# Altium schematic sheet ZYNQ JTAG and Decoupling.SchDoc
size A3; SheetNumber: 4; SheetTotal: 13; SPICEModelCacheIAXUMUHC: <root> / <DocumentId>IAXUMUHC</DocumentId> / <CacheFrame Number="0"> / <Model Name="led3" Kind="MDL"> / <Text>*Typ BLUE SiC LED: Vf=3.4V Vr=5V If=40mA trr=3uS / *LED Pinout: 1=A, 2=K / .MODEL LED3 D (IS=93.1P RS=42M N=7.47 BV=5 IBV=30U / + CJO=2.97P VJ=.75 M=.333 TT=4.32U)</Text> / </Model> / </CacheFrame> / </root>
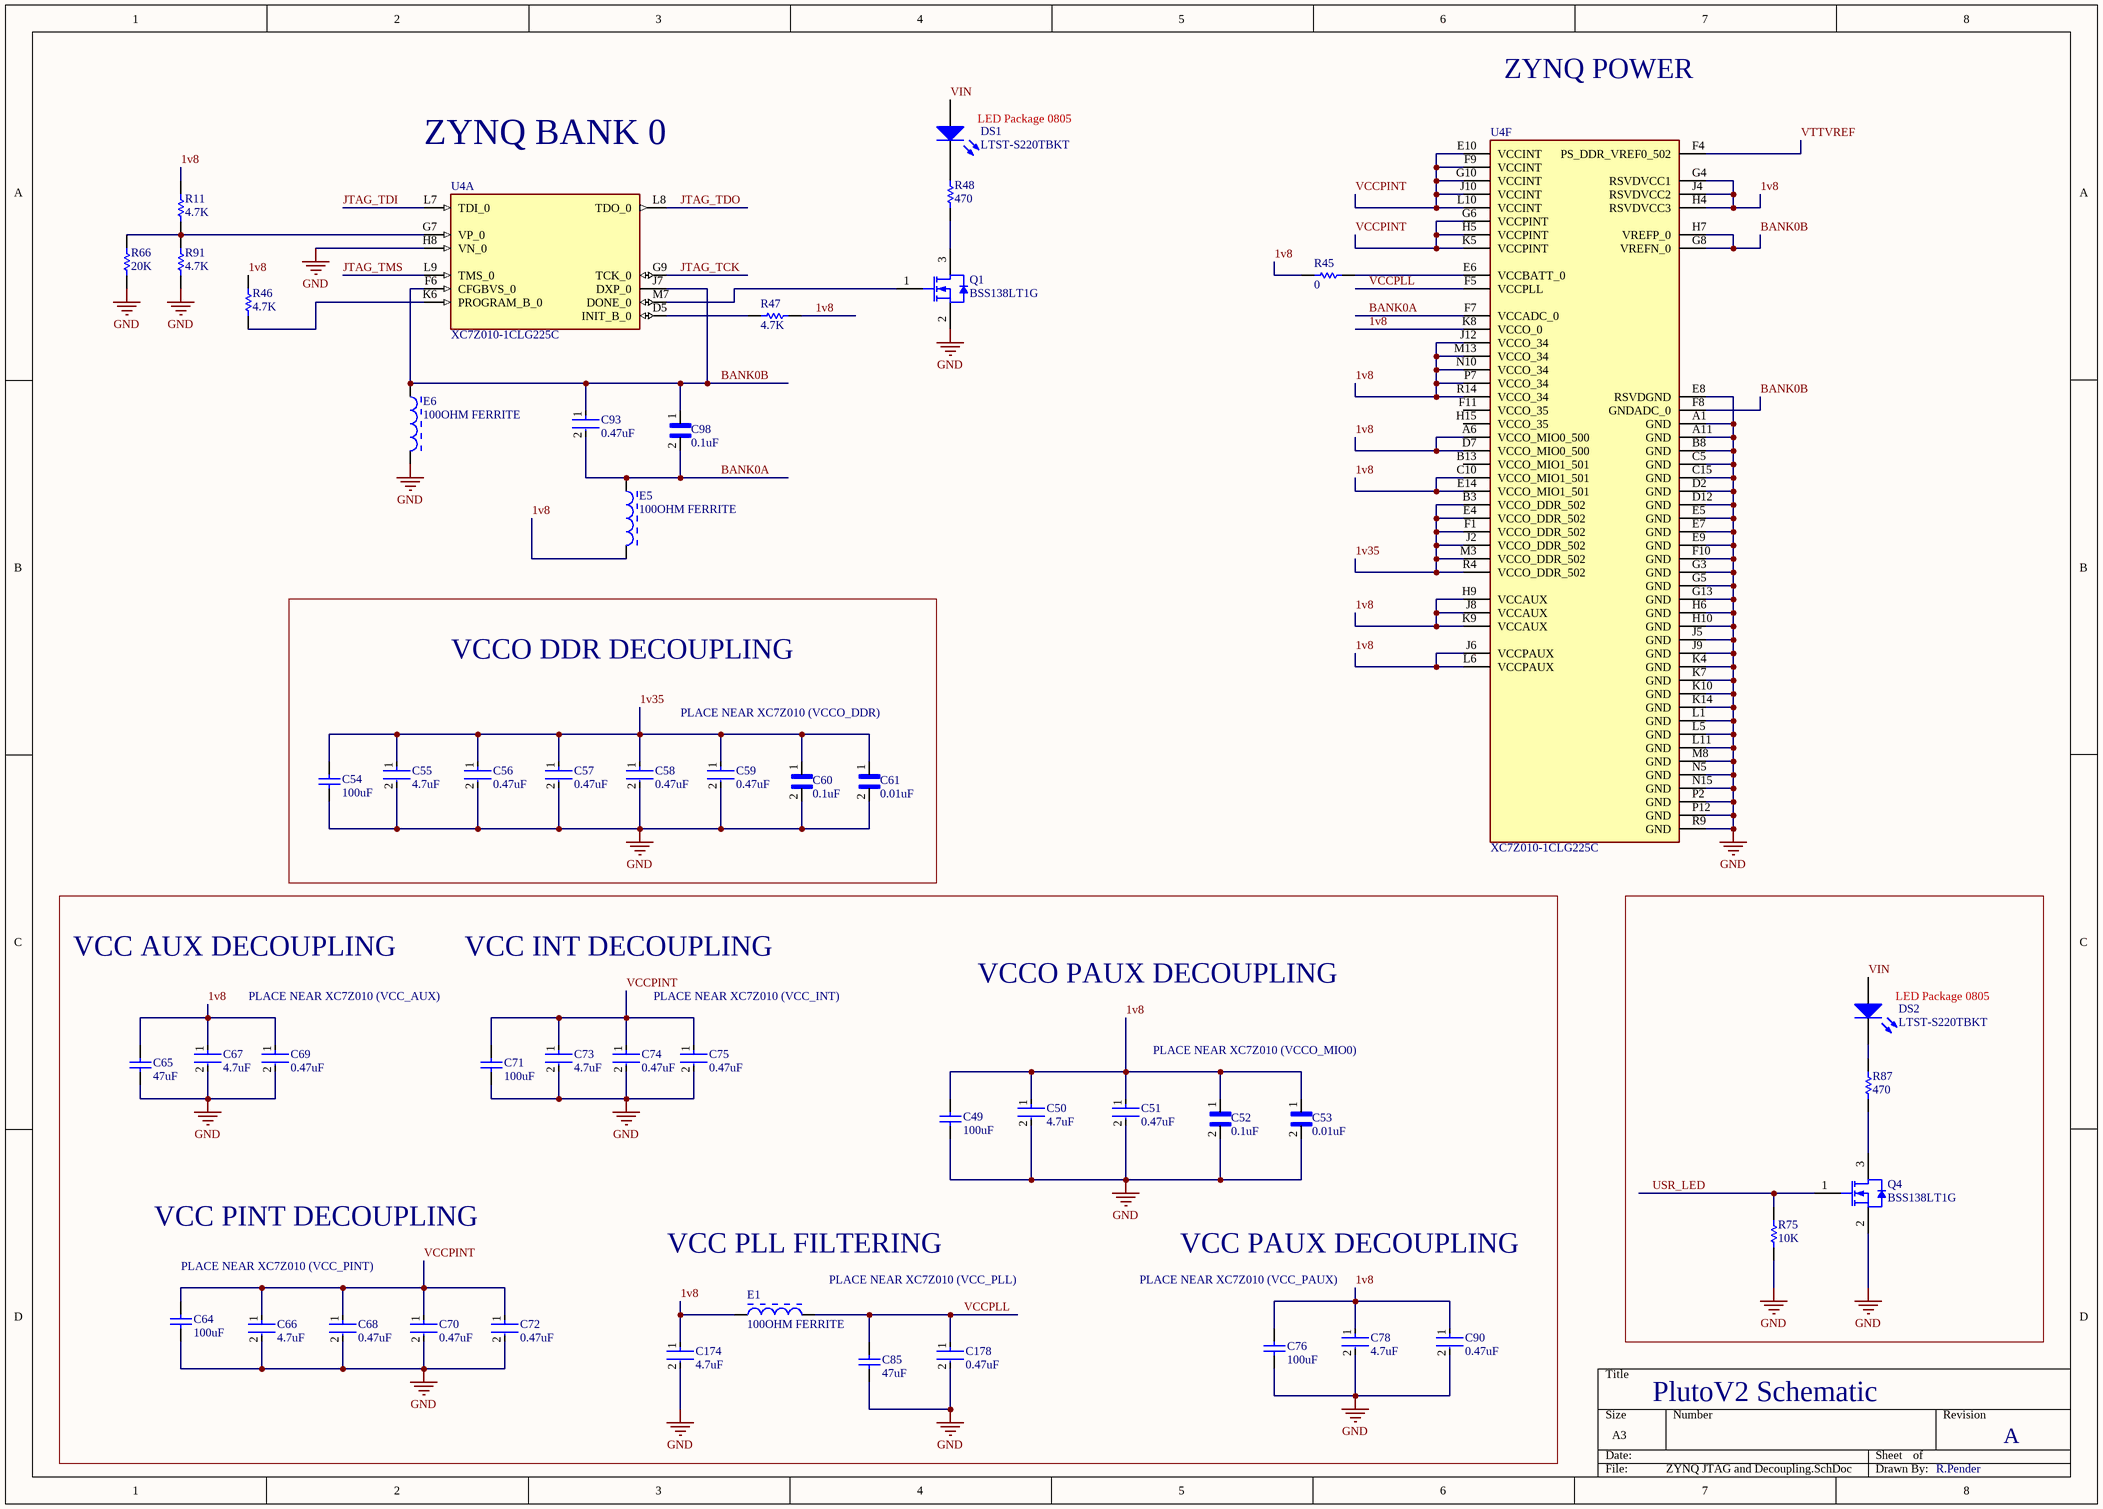
[diagram p0: ZYNQ JTAG and Decoupling.SchDoc]

## Parts
C49  100uF  [CAPC3216X190X55ML30T25]
C50  4.7uF  [FP-C1005-050-0_15-MFG]
C51  0.47uF  [FP-C1005-050-0_15-MFG]
C52  0.1uF  [CAPC0603X33N]
C53  0.01uF  [CAPC0603X33N]
C54  100uF  [CAPC3216X190X55ML30T25]
C55  4.7uF  [FP-C1005-050-0_15-MFG]
C56  0.47uF  [FP-C1005-050-0_15-MFG]
C57  0.47uF  [FP-C1005-050-0_15-MFG]
C58  0.47uF  [FP-C1005-050-0_15-MFG]
C59  0.47uF  [FP-C1005-050-0_15-MFG]
C60  0.1uF  [CAPC0603X33N]
C61  0.01uF  [CAPC0603X33N]
C64  100uF  [CAPC3216X190X55LL30T25]
C65  47uF  [TAYO-JMK212BBJ476MG-T_L]
C66  4.7uF  [FP-C1005-050-0_15-MFG]
C67  4.7uF  [FP-C1005-050-0_15-MFG]
C68  0.47uF  [FP-C1005-050-0_15-MFG]
C69  0.47uF  [FP-C1005-050-0_15-MFG]
C70  0.47uF  [FP-C1005-050-0_15-MFG]
C71  100uF  [CAPC3216X190X55LL30T25]
C72  0.47uF  [FP-C1005-050-0_15-MFG]
C73  4.7uF  [FP-C1005-050-0_15-MFG]
C74  0.47uF  [FP-C1005-050-0_15-MFG]
C75  0.47uF  [FP-C1005-050-0_15-MFG]
C76  100uF  [CAPC3216X190X55LL30T25]
C78  4.7uF  [FP-C1005-050-0_15-MFG]
C85  47uF  [TAYO-JMK212BBJ476MG-T_L]
C90  0.47uF  [FP-C1005-050-0_15-MFG]
C93  0.47uF  [FP-C1005-050-0_15-MFG]
C98  0.1uF  [CAPC0603X33N]
C174  4.7uF  [FP-C1005-050-0_15-MFG]
C178  0.47uF  [FP-C1005-050-0_15-MFG]
DS1  LTST-S220TBKT  [CAPC2012X135N]
DS2  LTST-S220TBKT  [CAPC2012X135N]
E1  100OHM FERRITE  [TDK-MPZ2012S101A-2_V]
E5  100OHM FERRITE  [TDK-MPZ2012S101A-2_V]
E6  100OHM FERRITE  [TDK-MPZ2012S101A-2_V]
Q1  BSS138LT1G  [ONSC-SOT-23-3-318-08_V]
Q4  BSS138LT1G  [ONSC-SOT-23-3-318-08_V]
R11  4.7K  [2-0402]
R45  0  [RESC1005X40X25ML10T10]
R46  4.7K  [2-0402]
R47  4.7K  [2-0402]
R48  470  [2-0402]
R66  20K  [2-0402]
R75  10K  [2-0402]
R87  470  [2-0402]
R91  4.7K  [2-0402]
U4  XC7Z010-1CLG225C  [BGA225C80P15X15_1300X1300X150]  (parts A,F of 6)

## Blocks framed on the sheet
VCCO DDR DECOUPLING: C54-C61
LED Package 0805: DS2 Q4 R75 R87

## Nets
GND: C49.2 C50.2 C51.2 C52.2 C53.2 C54.1 C55.2 C56.2 C57.2 C58.2 C59.2 C60.2 C61.2 C64.1 C65.2 C66.2 C67.2 C68.2 C69.2 C70.2 C71.1 C72.2 C73.2 C74.2 C75.2 C76.2 C78.2 C85.1 C90.2 C174.2 C178.2 E6.2 Q1.2(S) Q4.2(S) R66.2 R75.2 R91.2 U4.A1(GND) U4.A11(GND) U4.B8(GND) U4.C5(GND) U4.C15(GND) U4.D2(GND) U4.D12(GND) U4.E5(GND) U4.E7(GND) U4.E8(RSVDGND) U4.E9(GND) U4.F10(GND) U4.G3(GND) U4.G5(GND) U4.G13(GND) U4.H6(GND) U4.H8(VN_0) U4.H10(GND) U4.J5(GND) U4.J9(GND) U4.K4(GND) U4.K7(GND) U4.K10(GND) U4.K14(GND) U4.L1(GND) U4.L5(GND) U4.L11(GND) U4.M8(GND) U4.N5(GND) U4.N15(GND) U4.P2(GND) U4.P12(GND) U4.R9(GND)
1v8: C49.1 C50.1 C51.1 C52.1 C53.1 C65.1 C67.1 C69.1 C76.1 C78.1 C90.1 C174.1 E1.1 E5.2 R11.1 R45.1 R46.1 R47.1 U4.A6(VCCO_MIO0_500) U4.C10(VCCO_MIO1_501) U4.D7(VCCO_MIO0_500) U4.E14(VCCO_MIO1_501) U4.G4(RSVDVCC1) U4.H4(RSVDVCC3) U4.H9(VCCAUX) U4.J4(RSVDVCC2) U4.J6(VCCPAUX) U4.J8(VCCAUX) U4.J12(VCCO_34) U4.K8(VCCO_0) U4.K9(VCCAUX) U4.L6(VCCPAUX) U4.M13(VCCO_34) U4.N10(VCCO_34) U4.P7(VCCO_34) U4.R14(VCCO_34)
1v35: C54.2 C55.1 C56.1 C57.1 C58.1 C59.1 C60.1 C61.1 U4.B3(VCCO_DDR_502) U4.E4(VCCO_DDR_502) U4.F1(VCCO_DDR_502) U4.J2(VCCO_DDR_502) U4.M3(VCCO_DDR_502) U4.R4(VCCO_DDR_502)
BANK0A: C93.2 C98.2 E5.1 U4.F7(VCCADC_0)
BANK0B: C93.1 C98.1 E6.1 U4.F6(CFGBVS_0) U4.F8(GNDADC_0) U4.G8(VREFN_0) U4.H7(VREFP_0) U4.J7(DXP_0)
JTAG_TCK: U4.G9(TCK_0)
JTAG_TDI: U4.L7(TDI_0)
JTAG_TDO: U4.L8(TDO_0)
JTAG_TMS: U4.L9(TMS_0)
USR_LED: Q4.1(G) R75.1
VCCPINT: C64.2 C66.1 C68.1 C70.1 C71.2 C72.1 C73.1 C74.1 C75.1 U4.E10(VCCINT) U4.F9(VCCINT) U4.G6(VCCPINT) U4.G10(VCCINT) U4.H5(VCCPINT) U4.J10(VCCINT) U4.K5(VCCPINT) U4.L10(VCCINT)
VCCPLL: C85.2 C178.1 E1.2 U4.F5(VCCPLL)
VIN: DS1.1(A) DS2.1(A)
VTTVREF: U4.F4(PS_DDR_VREF0_502)
NetDS1_2: DS1.2(K) R48.1
NetDS2_2: DS2.2(K) R87.1
NetQ1_1: Q1.1(G) U4.M7(DONE_0)
NetQ1_3: Q1.3(D) R48.2
NetQ4_3: Q4.3(D) R87.2
NetR11_2: R11.2 R66.1 R91.1 U4.G7(VP_0)
NetR45_2: R45.2 U4.E6(VCCBATT_0)
NetR46_2: R46.2 U4.K6(PROGRAM_B_0)
NetR47_2: R47.2 U4.D5(INIT_B_0)

Not connected (* = marked no-connect by the designer): U4 B13(VCCO_MIO1_501) F11(VCCO_35) H15(VCCO_35)

## Notes on the sheet
- ZYNQ POWER
- ZYNQ BANK 0
- (near DS1) LED Package 0805
- PLACE NEAR XC7Z010 (VCCO_DDR)
- VCC AUX DECOUPLING
- VCC INT DECOUPLING
- VCCO PAUX DECOUPLING
- PLACE NEAR XC7Z010 (VCC_AUX)
- PLACE NEAR XC7Z010 (VCC_INT)
- PLACE NEAR XC7Z010 (VCCO_MIO0)
- VCC PINT DECOUPLING
- VCC PLL FILTERING
- VCC PAUX DECOUPLING
- PLACE NEAR XC7Z010 (VCC_PINT)
- (near E1) PLACE NEAR XC7Z010 (VCC_PLL)
- PLACE NEAR XC7Z010 (VCC_PAUX)
- PlutoV2 Schematic
- A
- R.Pender

## Library data of the parts
C49 C54 C64 C71 C76 = CMP-1662-00011-2: Chip Capacitor, 100 uF, +/- 20%, 6.3 V, -55 to 85 degC, 1206 (3216 Metric), RoHS, Tape and Reel; PartNumber: GRM31CR60J107ME39L; Case\/Package: 1206; Voltage Rating (DC): 6.3 V; Type (Capacitors): X5R; REACH SVHC: No SVHC; Height: 1.6 mm; Tolerance: 20%; Packaging: Tape and Reel; Mount: Surface Mount; PackageDescription: 2-Pin Surface Mount Device, Body 3.2 x 1.6 mm; ComponentLink1URL: http://www.murata.com/; Pins: 2; ComponentLink2Description: Datasheet; PackageReference: 1206; Width: 1.6 mm; Package Quantity: 2000; Capacitance: 100 uF; Min Operating Temperature: -55 degC; Case Code (Imperial): 1206; Max Operating Temperature: 85 degC; DatasheetVersion: 09/2016; Mounting Technology: Surface Mount; Voltage Rating: 6.3 V; ComponentLink1Description: Manufacturer URL; Radiation Hardening: No; Case Code (Metric): 3216; Length: 3.2 mm; ComponentLink2URL: http://psearch.en.murata.com/capacitor/product/GRM31CR60J107ME39%23.pdf; RoHSCompliant: true
C50 C51 C55-C59 C66-C70 C72-C75 C78 C90 C93 C174 C178 = CMP-2000-05437-2: CAP CER 4.7UF 6.3V X5R 0402; Tolerance: 10%; Dielectric Material: Ceramic; Voltage: 6.3V; Capacitance: 4.7uF; Depth: 0.5mm; Height: 0.5mm; Length: 1mm; Termination: SMD/SMT; RoHS Compliant: Yes; Series: C; Case/Package: 0402; Dielectric: X5R; Lead Free: Lead Free; Mount: Surface Mount; Max Operating Temperature: 85°C; Min Operating Temperature: -55°C
C52 C60 C98 = GRM033R61C104ME84D: CAP 0.1UF 16VDC X5R 20% SMD 0201 PAPER TAPE; Package: None; Price: None; Value: *; MP: GRM033R61C104ME84D; Availability: Unavailable
C53 C61 = GRM033R71A103KA01D: SMD Capacitor X7R(EIA) with Capacitance: 10000pF Tol. 10%. Rated Voltage: 10Vdc; MF: Murata; Package: 0603 Taiyo Yuden; MP: GRM033R71A103KA01D; Value: *; SnapEDA_Link: https://www.snapeda.com/parts/GRM033R71A103KA01D/Murata/view-part/4379446/?ref=snap; Availability: Unavailable; Price: None; Check_prices: https://www.snapeda.com/parts/GRM033R71A103KA01D/Murata/view-part/4379446/?ref=eda
C65 C85 = CMP-2000-06498-1: High Value Multilayer Ceramic Capacitor, 47 uF, +/-20%, 6.3 V, -55 to 85 degC, 2-Pin SMD (0805), RoHS, Tape and Reel; Manufacturer: Taiyo Yuden; PCN Part Number: X5R,X7RDielectrics23/Jan/2008; Kits: 587-1797-KIT-ND-KITCAPCERHICAP0603&0805S; Temperature Coefficient: X5R; Tolerance: ±20%; Online Catalog: MSeries; Other Names: 587-1779-1; Capacitance: 47µF; Voltage - Rated: 6.3V; Catalog Drawings: xMKSeries_0805_1.25; Operating Temperature: -55°C~85°C; Mounting Technology: SurfaceMount; Package Reference: 0805; Features: -; Lead Spacing: -; Lead Style: -; Family: CeramicCapacitors; Size / Dimension: 0.079"Lx0.049"W(2.00mmx1.25mm); Package Description: 2-Pin SMD, Body 2.2 x 1.45 mm; Mounting Type: SurfaceMount,MLCC; Package / Case: 0805(2012Metric); Series: M; Category: Capacitors; Packaging: CutTape(CT); Datasheet Version: 10/2015; Datasheet URL: http://datasheet.octopart.com/JMK212BJ476MG-T-Taiyo-Yuden-datasheet-62109412.pdf; Manufacturer URL: http://www.t-yuden.com/; Ratings: -; Height - Seated (Max): -; Standard Package: 1; Thickness (Max): 0.053"(1.35mm); Applications: GeneralPurpose
DS1 DS2 = LED3: Typical BLUE SiC LED; Published: 8-Jun-2000; LatestRevisionDate: 17-Dec-2003; LatestRevisionNote: PCB Footprint replaced.; DatasheetVersion: 16-Apr-2002; PackageVersion: 16-Apr-2002; PackageReference: 3.5X2.8X1.9; Publisher: Altium Limited; PackageDescription: SM LED; 2 C-Bend Leads; Body 3.5 x 2.8 x 1.9 mm, inc leads (LxWxH typ)
E1 E5 E6 = CMP-2000-05399-1: Chip Bead for Power Line, 100 Ohm, +/- 25%, 4 A, -55 to 125 degC, 0805 (2012 Metric), RoHS, Tape and Reel; Manufacturer: TDK; Maximum DC Resistance: 20mOhms; Test Frequency: 100MHz; Impedance: 100Ohms; Case Width: 1.25mm; Case Length: 2mm; Maximum DC Current: 4A; Case Height: 0.85mm; Package Reference: MPZ2012S101A-2; RoHS: Details; Tolerance: 25%; Operating Temperature Range: -55Cto+125C; Datasheet Version: Jul-13; Dimensions: 1.25mmWx2mmLx0.85mmH; Product: FerriteChipBeads; Termination Style: SMD/SMT; Datasheet URL: http://www.farnell.com/datasheets/1750041.pdf; Factory Pack Quantity: 4000; Brand: TDK; Packaging: Reel; Package Description: 2-Pin Surface Mount Device, Body 2 x 1.25 mm; Product Category: EMIFilterBeads,Chips&Arrays; Manufacturer URL: http://www.tdk.com/; Package / Case: 0805(2012metric)
Q1 Q4 = CMP-1058-00767-1: Power MOSFET, 200 mA, 50 V, N-Channel, 3-Pin SOT-23, Pb-Free, Tape and Reel; Manufacturer: On Semiconductor; PD Max (W): 0.225; Coss Typ (pF): 12; V(BR)DSS Min (V): 50; VGS Max (V): 20; Channel Polarity: N Channel; Configuration: Single; VGS(th) Max (V): 1.5; Ciss Typ (pF): 40; Crss Typ (pF): 3.5; ID Max (A): 0.2; ComponentLink3Description: Package Specification; PackageDescription: 3-Pin Small Outline Transistor, Body 2.92 x 1.3 mm, Pitch 0.95 mm; PackageReference: SOT-23-3-318-08; RoHS: Pb-Free; Mounting Technology: Surface Mount; ComponentLink1Description: Manufacturer URL; ComponentLink2URL: http://www.onsemi.com/pub_link/Collateral/BSS138LT1-D.PDF; ComponentLink2Description: Datasheet; Packing: Tape and Reel; PackageVersion: Rev. AP, 11/2009; PartNumber: BSS138LT1G; Package Type: SOT-23-3; ComponentLink1URL: http://www.onsemi.com/; DatasheetVersion: Rev. 8; ComponentLink3URL: http://www.onsemi.cn/pub_link/Collateral/318-08.PDF
R11 R46 R47 R66 R75 R91 = ERJ2RK: Precision Thick Film Chip Resistor, 10 Ohm to 1M Ohm Range, 1% and 0.5% Tolerance, 0402 Size, 0.063 W; Published: 17-Dec-2003; LatestRevisionDate: 19-Mar-2004; LatestRevisionNote: Silkscreen size reduced.; PackageDocument: Mar-2003; PackageReference: 2-0402; Publisher: Altium Limited; Code_IPC: 1005 [0402]; ComponentLink1Description: Manufacturer Link; ComponentLink1URL: http://www.panasonic.com/industrial/components/resistive_products.htm; ComponentLink2Description: Datasheet; ComponentLink2URL: http://www.panasonic.com/industrial/components/pdf/AOA0000CE2.pdf
R45 = CMP-2002-05896-1: Part Number: MC00625W040210R; Manufacturer: Multicomp
R48 R87 = ERJ2GE: Thick Film Chip Resistor, 1 Ohm to 2.2M Ohm Range, 5% Tolerance, 0402 Size, 0.063 W; Note: If flow soldering, adjust pad width of PCB Footprint to 0.7 - 0.8 times the width of the resistor.; Published: 17-Dec-2003; LatestRevisionDate: 19-Mar-2004; LatestRevisionNote: Silkscreen size reduced.; PackageDocument: Mar-2003; PackageReference: 2-0402; Publisher: Altium Limited; Code_IPC: 1005 [0402]; ComponentLink1Description: Manufacturer Link; ComponentLink1URL: http://www.panasonic.com/industrial/components/resistive_products.htm; ComponentLink2Description: Datasheet; ComponentLink2URL: http://www.panasonic.com/industrial/components/pdf/AOA0000CE1.pdf
U4 = XC7Z010-1CLG225C: Dual ARMÂ® CortexÂ®-A9 MPCoreâ„¢ with CoreSightâ„¢ System On Chip _SOC_ IC ZynqÂ®-7000 Artixâ„¢-7 FPGA, 28K Logic Cells 667MHz 225-CSPBGA _13x13_; MF: Xilinx Inc.; Value: *; SnapEDA_Link: https://www.snapeda.com/parts/XC7Z010-1CLG225C/Xilinx%20Inc./view-part/45778/?ref=snap; Digi-Key_Part_Number: 122-1855-ND; Package: CSPBGA-225 Xilinx; Digi-Key_Purchase_URL: https://www.digikey.by/product-detail/en/xilinx-inc/XC7Z010-1CLG225C/122-1855-ND/3925788?utm_source=snapeda&utm_medium=aggregator&utm_campaign=symbol; MP: XC7Z010-1CLG225C